# EAGLE schematic PiZeroAudioI2S (EAGLE 9.4.1)
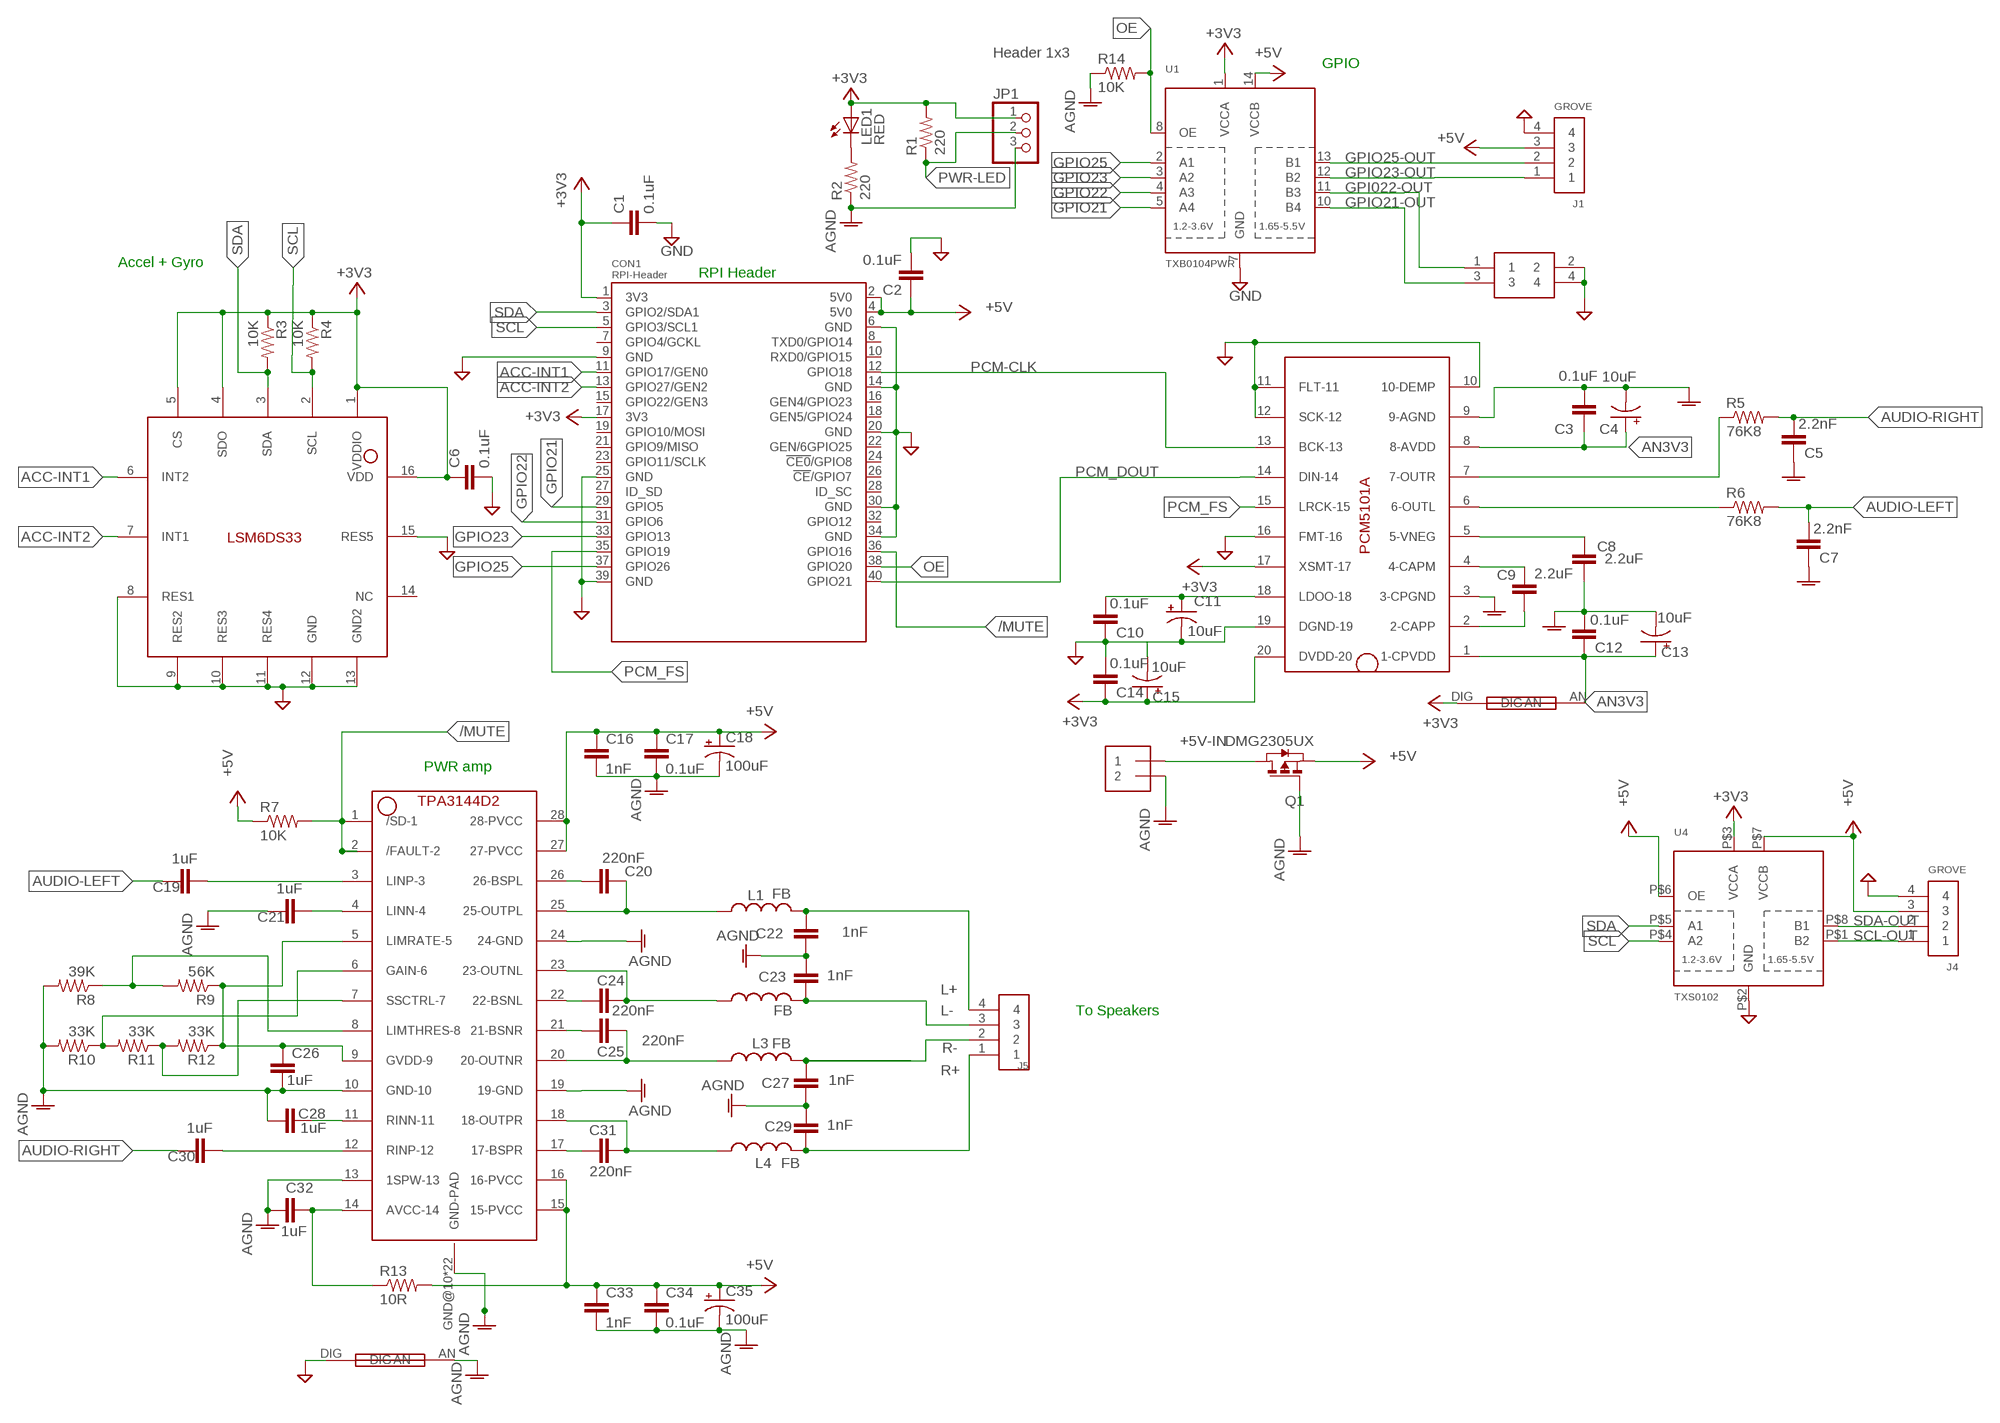
[diagram p0: schematic, sheet 1]

## Parts
C1  0.1uF  C-EUC0603  [C0603]
C2  0.1uF  C-EUC0603  [C0603]
C3  0.1uF  C-EUC0603  [C0603]
C4  10uF  CAP-POLARISED1206-POLAR  [EIA3216]
C5  2.2nF  C-EUC0603  [C0603]
C6  0.1uF  C-EUC0603  [C0603]
C7  2.2nF  C-EUC0603  [C0603]
C8  2.2uF  C-EUC0603  [C0603]
C9  2.2uF  C-EUC0603  [C0603]
C10  0.1uF  C-EUC0603  [C0603]
C11  10uF  CAP-POLARISED1206-POLAR  [EIA3216]
C12  0.1uF  C-EUC0603  [C0603]
C13  10uF  CAP-POLARISED1206-POLAR  [EIA3216]
C14  0.1uF  C-EUC0603  [C0603]
C15  10uF  CAP-POLARISED1206-POLAR  [EIA3216]
C16  1nF  C-EUC0603  [C0603]
C17  0.1uF  C-EUC0603  [C0603]
C18  100uF  CAP-POLARISED1206-POLAR  [EIA3216]
C19  1uF  C-EUC0603  [C0603]
C20  220nF  C-EUC0603  [C0603]
C21  1uF  C-EUC0603  [C0603]
C22  1nF  C-EUC0603  [C0603]
C23  1nF  C-EUC0603  [C0603]
C24  220nF  C-EUC0603  [C0603]
C25  220nF  C-EUC0603  [C0603]
C26  1uF  C-EUC0603  [C0603]
C27  1nF  C-EUC0603  [C0603]
C28  1uF  C-EUC0603  [C0603]
C29  1nF  C-EUC0603  [C0603]
C30  1uF  C-EUC0603  [C0603]
C31  220nF  C-EUC0603  [C0603]
C32  1uF  C-EUC0603  [C0603]
C33  1nF  C-EUC0603  [C0603]
C34  0.1uF  C-EUC0603  [C0603]
C35  100uF  CAP-POLARISED1206-POLAR  [EIA3216]
CON1  RPI-Header  RPI-ZERO  [RASPBERRYPI_BASTELSTUBE_V13_RASPI_BOARD_B+_FULL]
J1  GROVE  [JST-PH4]
J2  2X2HEADER  [2X2]
J3  2X1-LOCKING  [22-23-2021]
J4  GROVE  [JST-PH4]
J5  4X1-LOCKING  [22-23-2041]
JP1  Header 1x3  PINHD-1X3  [1X03]
L1  FB  NFZ2MSML0806  [L0806]
L2  FB  NFZ2MSML0806  [L0806]
L3  FB  NFZ2MSML0806  [L0806]
L4  FB  NFZ2MSML0806  [L0806]
LED1  RED  LEDCHIP-LED0805  [CHIP-LED0805]
Q1  DMG2305UX  [SOT23]
R1  220  R-US_R0603  [R0603]
R2  220  R-US_R0603  [R0603]
R3  10K  R-US_R0603  [R0603]
R4  10K  R-US_R0603  [R0603]
R5  76K8  R-US_R0603  [R0603]
R6  76K8  R-US_R0603  [R0603]
R7  10K  R-US_R0603  [R0603]
R8  39K  R-US_R0603  [R0603]
R9  56K  R-US_R0603  [R0603]
R10  33K  R-US_R0603  [R0603]
R11  33K  R-US_R0603  [R0603]
R12  33K  R-US_R0603  [R0603]
R13  10R  R-US_R0603  [R0603]
R14  10K  R-US_R0603  [R0603]
SH1  SHORT  [SHORT]
SH2  SHORT  [SHORT]
U1  TXB0104PWR  [TSSOP14]
U2  LSM6DS33  LSM6DS33LGA-16-3X3  [LGA-16-3X3]
U3  PCM5101A  [TSSOP20-0.65-6.5X4.4MM]
U4  TXS0102  [VFSOP-8]
U5  TPA3144D2PWPR  [HTSSOP28]

## Nets
+3V3: C1.1 C6.1 C14.2 C15.+ CON1.1(3V3) CON1.17(3V3) JP1.1 LED1.A R1.2 R3.1 R4.1 SH1.DIG U1.1(VCCA) U2.1(VDDIO) U2.4(SDO) U2.5(CS) U2.16(VDD) U3.17(XSMT-17) U3.20(DVDD-20) U4.P$3(VCCA)
+5V: C2.1 C16.1 C17.1 C18.+ C33.1 C34.1 C35.+ CON1.2(5V0) CON1.4(5V0) J1.3 J4.3 Q1.S R7.1 R13.2 U1.14(VCCB) U4.P$6(OE) U4.P$7(VCCB) U5.15(15-PVCC) U5.16(16-PVCC) U5.27(27-PVCC) U5.28(28-PVCC)
+5V-IN: J3.1 Q1.D
/MUTE: CON1.36(GPIO16) R7.2 U5.1(/SD-1) U5.2(/FAULT-2)
ACC-INT1: CON1.11(GPIO17/GEN0) U2.6(INT2)
ACC-INT2: CON1.13(GPIO27/GEN2) U2.7(INT1)
AGND: C3.1 C4.- C5.2 C7.2 C8.2 C12.1 C13.- C16.2 C17.2 C18.- C21.2 C22.2 C23.1 C26.2 C27.2 C28.2 C29.1 C32.2 C33.2 C34.2 C35.- J3.2 JP1.3 Q1.G R2.1 R8.2 R10.2 R14.1 SH2.AN U3.3(3-CPGND) U3.9(9-AGND) U5.10(GND-10) U5.13(1SPW-13) U5.19(19-GND) U5.24(24-GND) U5.GND@10(GND-PAD) U5.GND@11(GND-PAD) U5.GND@12(GND-PAD) U5.GND@13(GND-PAD) U5.GND@14(GND-PAD) U5.GND@15(GND-PAD) U5.GND@16(GND-PAD) U5.GND@17(GND-PAD) U5.GND@18(GND-PAD) U5.GND@19(GND-PAD) U5.GND@20(GND-PAD) U5.GND@21(GND-PAD) U5.GND@22(GND-PAD) U5.GND@23(GND-PAD) U5.GND@24(GND-PAD) U5.GND@25(GND-PAD) U5.GND@26(GND-PAD) U5.GND@27(GND-PAD) U5.GND@28(GND-PAD) U5.GND@29(GND-PAD) U5.GND@30(GND-PAD) U5.GND@PAD(GND-PAD)
AN3V3: C3.2 C4.+ C12.2 C13.+ SH1.AN U3.1(1-CPVDD) U3.8(8-AVDD)
AUDIO-LEFT: C7.1 C19.2 R6.2
AUDIO-RIGHT: C5.1 C30.2 R5.2
GND: C1.2 C2.2 C6.2 C10.2 C11.- C14.1 C15.- CON1.6(GND) CON1.9(GND) CON1.14(GND) CON1.20(GND) CON1.25(GND) CON1.30(GND) CON1.34(GND) CON1.39(GND) J1.4 J2.2 J2.4 J4.4 SH2.DIG U1.7(GND) U2.8(RES1) U2.9(RES2) U2.10(RES3) U2.11(RES4) U2.12(GND) U2.13(GND2) U2.15(RES5) U3.10(10-DEMP) U3.11(FLT-11) U3.12(SCK-12) U3.16(FMT-16) U3.19(DGND-19) U4.P$2(GND)
GPI022-OUT: J2.1 U1.11(B3)
GPIO21: CON1.29(GPIO5) U1.5(A4)
GPIO21-OUT: J2.3 U1.10(B4)
GPIO22: CON1.31(GPIO6) U1.4(A3)
GPIO23: CON1.33(GPIO13) U1.3(A2)
GPIO23-OUT: J1.1 U1.12(B2)
GPIO25: CON1.37(GPIO26) U1.2(A1)
GPIO25-OUT: J1.2 U1.13(B1)
L+: C22.1 J5.4 L1.2
L-: C23.2 J5.3 L2.2
N$1: R5.1 U3.7(7-OUTR)
N$2: C8.1 U3.5(5-VNEG)
N$3: C9.1 U3.4(4-CAPM)
N$4: C9.2 U3.2(2-CAPP)
N$6: LED1.C R2.2
N$7: C21.1 U5.4(LINN-4)
N$8: C28.1 U5.11(RINN-11)
N$9: C32.1 R13.1 U5.14(AVCC-14)
N$10: C31.2 U5.17(17-BSPR)
N$11: R6.1 U3.6(6-OUTL)
N$12: C10.1 C11.+ U3.18(LDOO-18)
N$13: C25.2 U5.21(21-BSNR)
N$14: C19.1 U5.3(LINP-3)
N$15: C30.1 U5.12(RINP-12)
N$16: C24.2 U5.22(22-BSNL)
N$17: C20.2 U5.26(26-BSPL)
N$18: C20.1 L1.1 U5.25(25-OUTPL)
N$19: C24.1 L2.1 U5.23(23-OUTNL)
N$20: C25.1 L3.1 U5.20(20-OUTNR)
N$21: C31.1 L4.1 U5.18(18-OUTPR)
N$23: R10.1 R11.2 U5.6(GAIN-6)
N$24: R11.1 R12.2 U5.7(SSCTRL-7)
N$25: R8.1 R9.2 U5.8(LIMTHRES-8)
N$26: C26.1 R9.1 R12.1 U5.5(LIMRATE-5) U5.9(GVDD-9)
OE: CON1.38(GPIO20) R14.2 U1.8(OE)
PCM-CLK: CON1.12(GPIO18) U3.13(BCK-13)
PCM_DOUT: CON1.40(GPIO21) U3.14(DIN-14)
PCM_FS: CON1.35(GPIO19) U3.15(LRCK-15)
PWR-LED: JP1.2 R1.1
R+: C29.2 J5.1 L4.2
R-: C27.1 J5.2 L3.2
SCL: CON1.5(GPIO3/SCL1) R4.2 U2.2(SCL) U4.P$4(A2)
SCL-OUT: J4.1 U4.P$1(B2)
SDA: CON1.3(GPIO2/SDA1) R3.2 U2.3(SDA) U4.P$5(A1)
SDA-OUT: J4.2 U4.P$8(B1)
Unconnected: CON1.7(GPIO4/GCKL) CON1.8(TXD0/GPIO14) CON1.10(RXD0/GPIO15) CON1.15(GPIO22/GEN3) CON1.16(GEN4/GPIO23) CON1.18(GEN5/GPIO24) CON1.19(GPIO10/MOSI) CON1.21(GPIO9/MISO) CON1.22(GEN/6GPIO25) CON1.23(GPIO11/SCLK) CON1.24(!CE0!/GPIO8) CON1.26(!CE!/GPIO7) CON1.27(ID_SD) CON1.28(ID_SC) CON1.32(GPIO12) U2.14(NC)

## Notes on the sheet
- GPIO
- Accel + Gyro | RPI Header
- PWR amp
- To Speakers

## Library data of the parts
C1-C3 C6 C10 C12 C14 C17 C19 C21 C26 C28 C30 C32 C34 = rcl:C-EU: CAPACITOR, European symbol; OC_FARNELL: unknown; SPICEPREFIX: C
C4 C11 C13 C15 = HappyBrackets:CAP-POLARISED: Polarised capacitor 0603 Footprint; MF: AVX; MPN: F931C106MAA; OC_FARNELL: 2852673
C5 C7 = rcl:C-EU: CAPACITOR, European symbol; MF: WALSIN; MPN: 0603B222K500CT; OC_FARNELL: 2496845; SPICEPREFIX: C
C8 C9 = rcl:C-EU: CAPACITOR, European symbol; MF: KEMET; MPN: C0603C225K8PACTU; OC_FARNELL: 1108322; SPICEPREFIX: C
C16 C22 C23 C27 C29 C33 = rcl:C-EU: CAPACITOR, European symbol; MF: AVX; MPN: 06035C102KAT2A; OC_FARNELL: 499134; SPICEPREFIX: C
C18 C35 = HappyBrackets:CAP-POLARISED: Polarised capacitor 0603 Footprint; MF: AVX; MPN: TLJA107M010R1400; OC_FARNELL: 2690441
C20 C24 C25 C31 = rcl:C-EU: CAPACITOR, European symbol; MF: TAIYO YUDEN; MPN: EMK107B7224KA-T; OC_FARNELL: 1683648; SPICEPREFIX: C
CON1 = RPI-Zero:RPI-ZERO; OC_FARNELL: unknown
J1 J4 = HappyBrackets:GROVE; OC_FARNELL: unknown
J2 = HappyBrackets:2X2HEADER: 2x2 2.54mm header; OC_FARNELL: unknown
J3 = HappyBrackets:2X1-LOCKING: 2x1 Locking Header https://www.molex.com/pdm_docs/sd/022272021_sd.pdf; MF: MOLEX; MPN: 22-23-2021; OC_FARNELL: 1462926
J5 = HappyBrackets:4X1-LOCKING; MF: MOLEX; MPN: 22-23-2041; OC_FARNELL: 1462920
JP1 = adafruit:PINHD-1X3: PIN HEADER; OC_FARNELL: unknown
L1-L4 = HappyBrackets:NFZ2MSM: Ferrite Bead https://www.digikey.com.au/product-detail/en/murata-electronics-north-america/NFZ2MSM301SN10L/490-14481-1-ND/6606942; OC_FARNELL: unknown
LED1 = adafruit:LED: LED OSRAM: - CHIPLED LG R971, LG N971, LY N971, LG Q971, LY Q971, LO R971, LY R971 LH N974, LH R974 LS Q976, LO Q976, LY Q976 LO Q996 - Hyper CHIPLED LW Q18S LB Q993, LB Q99A, LB R99A - SideLED LS A670, LO A670, LY A670, LG A670, LP A670 LB A673, LV A673, LT A673, LW A673 LH A674 LY A675 LS A676, LA A676, LO A676, LY A676, LW A676 LS A679, LY A679, LG A679 - Hyper Micro SIDELED® LS Y876, LA Y876, LO Y876, LY Y876 LT Y87S - SmartLED LW L88C, LW L88S LB L89C, LB L89S, LG L890 LS L89K, LO L89K, LY L89K LS L896, LA L896, LO L896, LY L896 - TOPLED LS T670, LO T670, LY T670, LG T670, LP T670 LSG T670, LSP T670, LSY T670, LOP T670, LYG T670 LG T671, LOG T671, LSG T671 LB T673, LV T673, LT T673, LW T673 LH T674 LS T676, LA T676, LO T676, LY T676, LB T676, LH T676, LSB T676, LW T676 LB T67C, LV T67C, LT T67C, LS T67K, LO T67K, LY T67K, LW E67C LS E67B, LA E67B, LO E67B, LY E67B, LB E67C, LV E67C, LT E67C LW T67C LS T679, LY T679, LG T679 LS T770, LO T770, LY T770, LG T770, LP T770 LB T773, LV T773, LT T773, LW T773 LH T774 LS E675, LA E675, LY E675, LS T675 LS T776, LA T776, LO T776, LY T776, LB T776 LHGB T686 LT T68C, LB T68C - Hyper Mini TOPLED® LB M676 - Mini TOPLED Santana® LG M470 LS M47K, LO M47K, LY M47K Source: http://www.osram.convergy.de/; OC_FARNELL: unknown
Q1 = HappyBrackets:DMG2305UX: P-CHANNEL ENHANCEMENT MODE MOSFET This MOSFET is designed to minimize the on-state resistance (RDS(ON)), yet maintain superior switching performance, making it ideal for high efficiency power management applications.; MF: DIODES INC.; MPN: DMG2305UX-7; OC_FARNELL: 2543533
R1 R2 R13 = adafruit:R-US_: RESISTOR, American symbol; OC_FARNELL: unknown
R3 R4 R7 R14 = adafruit:R-US_: RESISTOR, American symbol; MF: YAGEO; MPN: RC0603FR-0710KL; OC_FARNELL: 2133286
R5 R6 = adafruit:R-US_: RESISTOR, American symbol; MF: PANASONIC ELECTRONIC COMPONENTS; MPN: RMCF0603FT76K8; OC_FARNELL: 2303120
R8 = adafruit:R-US_: RESISTOR, American symbol; MF: YAGEO; MPN: RC0603FR-0739KL; OC_FARNELL: 9238670
R9 = adafruit:R-US_: RESISTOR, American symbol; MF: VISHAY; MPN: CRCW060356K0FKEA.; OC_FARNELL: 2138473RL
R10-R12 = adafruit:R-US_: RESISTOR, American symbol; MF: MULTICOMP; MPN: MCMR06X3302FTL; OC_FARNELL: 2073473
SH1 SH2 = HappyBrackets:SHORT: Creates a short so analogue and digital power can have different net names. You will need to approve DRC error checks to use this; OC_FARNELL: unknown
U1 = adafruit:TXB0104PWR: 4-Bit Bi-Directional Level Shifter 1.2V-3.6V (VCCA) to 1.65V-5.5V (VCCB) bi-directional level shifter with auto direction sensing. Max data rate - VCCA 1.8V: 20Mbps (50ns), VCCA 3.3V: 100Mbps (10ns) Digikey: 296-21929-1-ND; MF: TEXAS INSTRUMENTS; MPN: TXB0104PWR; OC_FARNELL: 1607891
U2 = HappyBrackets:LSM6DS33: iNEMO inertial module: always-on 3D accelerometer and 3D gyroscope; MF: STMICROELECTRONICS; MPN: LSM6DS33TR; OC_FARNELL: 2762756
U3 = HappyBrackets:PCM5101A: PCM510xA 2.1VRMS, 112/106/100dB AudioStereoDAC with PLL and 32-bit, 384 kHz PCM Interface; MF: TEXAS INSTRUMENTS; MPN: PCM5101AQPWRQ1; OC_FARNELL: 2402250
U4 = adafruit:TXS0102: 2-Bit Bi-Directional Level Shifter (I2C, etc.) Designed for I2C devices and has internal pullups. Not to be confused with TXB010x series. 1.2V-3.6V (VCCA) to 1.65V-5.5V (VCCB) bi-directional level shifter with auto direction sensing. Max data rate - 24Mbps (Push Pull), 2Mbps (Open Drain) Digikey: 296-21931-1-ND; OC_FARNELL: unknown
U5 = HappyBrackets:TPA3144D2PWPR: TPA3144D2PWPR 6-W Inductor Free Stereo (BTL) Class-D Audio Amplifier with Ultra Low EMI and AGL; OC_FARNELL: unknown

## Net classes
0 default: width 0.152 mm, clearance 0.152 mm
2 PWM-LEFT: width 0.305 mm, drill 0.508 mm, clearance 0.508 mm
3 PWM-RIGHT: width 0.305 mm, drill 0.508 mm, clearance 0.508 mm
4 AUDIO-L: width 0.305 mm, drill 0.508 mm, clearance 0.508 mm
5 AUDIO-R: width 0.305 mm, drill 0.508 mm, clearance 0.508 mm
6 +5V: width 0.508 mm, drill 0.508 mm, clearance 0.254 mm